# EAGLE design Servo-potenciom (EAGLE 7.2.0)
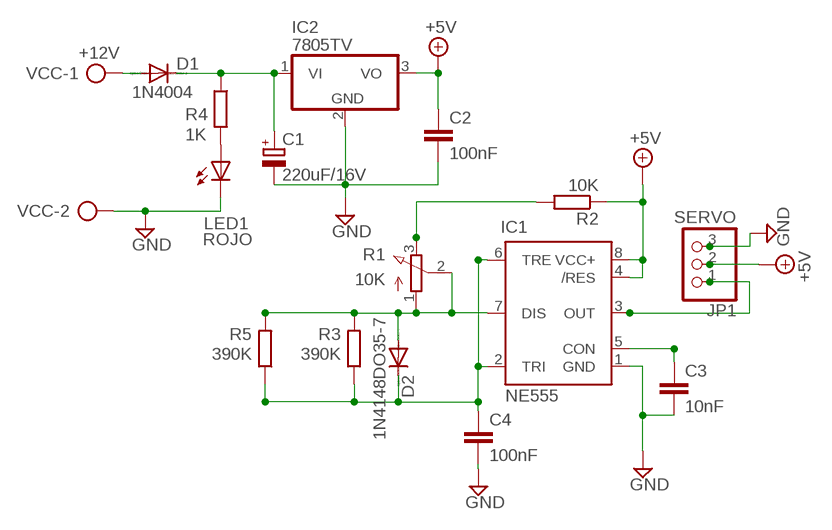
[diagram p0: schematic, sheet 1]

## Parts
C1  220uF/16V  CPOL-EUE2.5-7  [E2,5-7]
C2  100nF  C-EU050-025X075  [C050-025X075]
C3  10nF  C-EU050-025X075  [C050-025X075]
C4  100nF  C-EU050-025X075  [C050-025X075]
D1  1N4004  [DO41-10]
D2  1N4148DO35-7  [DO35-7]
IC1  NE555  [DIL-08]
IC2  7805TV  [TO220V]
JP1  SERVO  PINHD-1X3  [1X03]
LED1  ROJO  LED3MM  [LED3MM]
R1  10K  3RP/1610N  [3RP/1610N]
R2  10K  R-EU_0207/7  [0207/7]
R3  390K  R-EU_0207/7  [0207/7]
R4  1K  R-EU_0207/7  [0207/7]
R5  390K  R-EU_0207/7  [0207/7]
VCC  +12V  AK500/2-H  [AK500/2-H]

## Nets
+5V: C2.1 IC1.4(/RES) IC1.8(VCC+) IC2.3(VO) JP1.2 R2.1
GND: C1.- C2.2 C3.2 C4.2 IC1.1(GND) IC2.2(GND) JP1.3 LED1.K(C) VCC.2
N$1: D1.A VCC.1
N$2: C1.+ D1.C IC2.1(VI) R4.1
N$3: IC1.3(OUT) JP1.1
N$4: C3.1 IC1.5(CON)
N$5: R1.3(E) R2.2
N$6: D2.A IC1.7(DIS) R1.1(A) R1.2(S) R3.2 R5.2
N$7: C4.1 D2.C IC1.2(TRI) IC1.6(TRE) R3.1 R5.1
N$8: LED1.A R4.2

## Library data of the parts
C1 = rcl:CPOL-EU: POLARIZED CAPACITOR, European symbol
C2-C4 = rcl:C-EU: CAPACITOR, European symbol
D1 = diode:1N4004: DIODE general purpose rectifier, 1 A
D2 = diode:1N4148: DIODE high speed (Philips)
IC1 = st-microelectronics:NE555: General purpose bipolar Timer; MF: Arrow Electronics; MPN: NE555N; OC_FARNELL: 1467742; OC_NEWARK: 89K1486
IC2 = linear:78*: Positive VOLTAGE REGULATOR Source: http://cache.national.com/ds/LM/LM78L05.pdf http://www.fairchildsemi.com/ds/LM/LM7805.pdf
JP1 = pinhead:PINHD-1X3: PIN HEADER
LED1 = led:LED: LED OSRAM: - CHIPLED LG R971, LG N971, LY N971, LG Q971, LY Q971, LO R971, LY R971 LH N974, LH R974 LS Q976, LO Q976, LY Q976 LO Q996 - Hyper CHIPLED LW Q18S LB Q993, LB Q99A, LB R99A - SideLED LS A670, LO A670, LY A670, LG A670, LP A670 LB A673, LV A673, LT A673, LW A673 LH A674 LY A675 LS A676, LA A676, LO A676, LY A676, LW A676 LS A679, LY A679, LG A679 - Hyper Micro SIDELED® LS Y876, LA Y876, LO Y876, LY Y876 LT Y87S - SmartLED LW L88C, LW L88S LB L89C, LB L89S, LG L890 LS L89K, LO L89K, LY L89K LS L896, LA L896, LO L896, LY L896 - TOPLED LS T670, LO T670, LY T670, LG T670, LP T670 LSG T670, LSP T670, LSY T670, LOP T670, LYG T670 LG T671, LOG T671, LSG T671 LB T673, LV T673, LT T673, LW T673 LH T674 LS T676, LA T676, LO T676, LY T676, LB T676, LH T676, LSB T676, LW T676 LB T67C, LV T67C, LT T67C, LS T67K, LO T67K, LY T67K, LW E67C LS E67B, LA E67B, LO E67B, LY E67B, LB E67C, LV E67C, LT E67C LW T67C LS T679, LY T679, LG T679 LS T770, LO T770, LY T770, LG T770, LP T770 LB T773, LV T773, LT T773, LW T773 LH T774 LS E675, LA E675, LY E675, LS T675 LS T776, LA T776, LO T776, LY T776, LB T776 LHGB T686 LT T68C, LB T68C - Hyper Mini TOPLED® LB M676 - Mini TOPLED Santana® LG M470 LS M47K, LO M47K, LY M47K Source: http://www.osram.convergy.de LUXEON: - LUMILED® LXK2-PW12-R00, LXK2-PW12-S00, LXK2-PW14-U00, LXK2-PW14-V00 LXK2-PM12-R00, LXK2-PM12-S00, LXK2-PM14-U00 LXK2-PE12-Q00, LXK2-PE12-R00, LXK2-PE12-S00, LXK2-PE14-T00, LXK2-PE14-U00 LXK2-PB12-K00, LXK2-PB12-L00, LXK2-PB12-M00, LXK2-PB14-N00, LXK2-PB14-P00, LXK2-PB14-Q00 LXK2-PR12-L00, LXK2-PR12-M00, LXK2-PR14-Q00, LXK2-PR14-R00 LXK2-PD12-Q00, LXK2-PD12-R00, LXK2-PD12-S00 LXK2-PH12-R00, LXK2-PH12-S00 LXK2-PL12-P00, LXK2-PL12-Q00, LXK2-PL12-R00 Source: www.luxeon.com KINGBRIGHT: KA-3528ASYC Source: www.kingbright.com
R1 = pot:3RP/1610N: 16mm Potentiometer one level Source: http://www.alphapotentiometers.net/html/16mm_pot_2.html
R2-R5 = resistor:R-EU_: RESISTOR, European symbol
VCC = con-ptr500:AK500/2-H: CONNECTOR Aug. 2004 / PTR Meßtechnik: Die Bezeichnung der Serie AK505 wurde geändert. Es handelt sich hierbei um AK500 in horizontaler Ausführung.; OC_FARNELL: unknown; OC_NEWARK: unknown

## Board
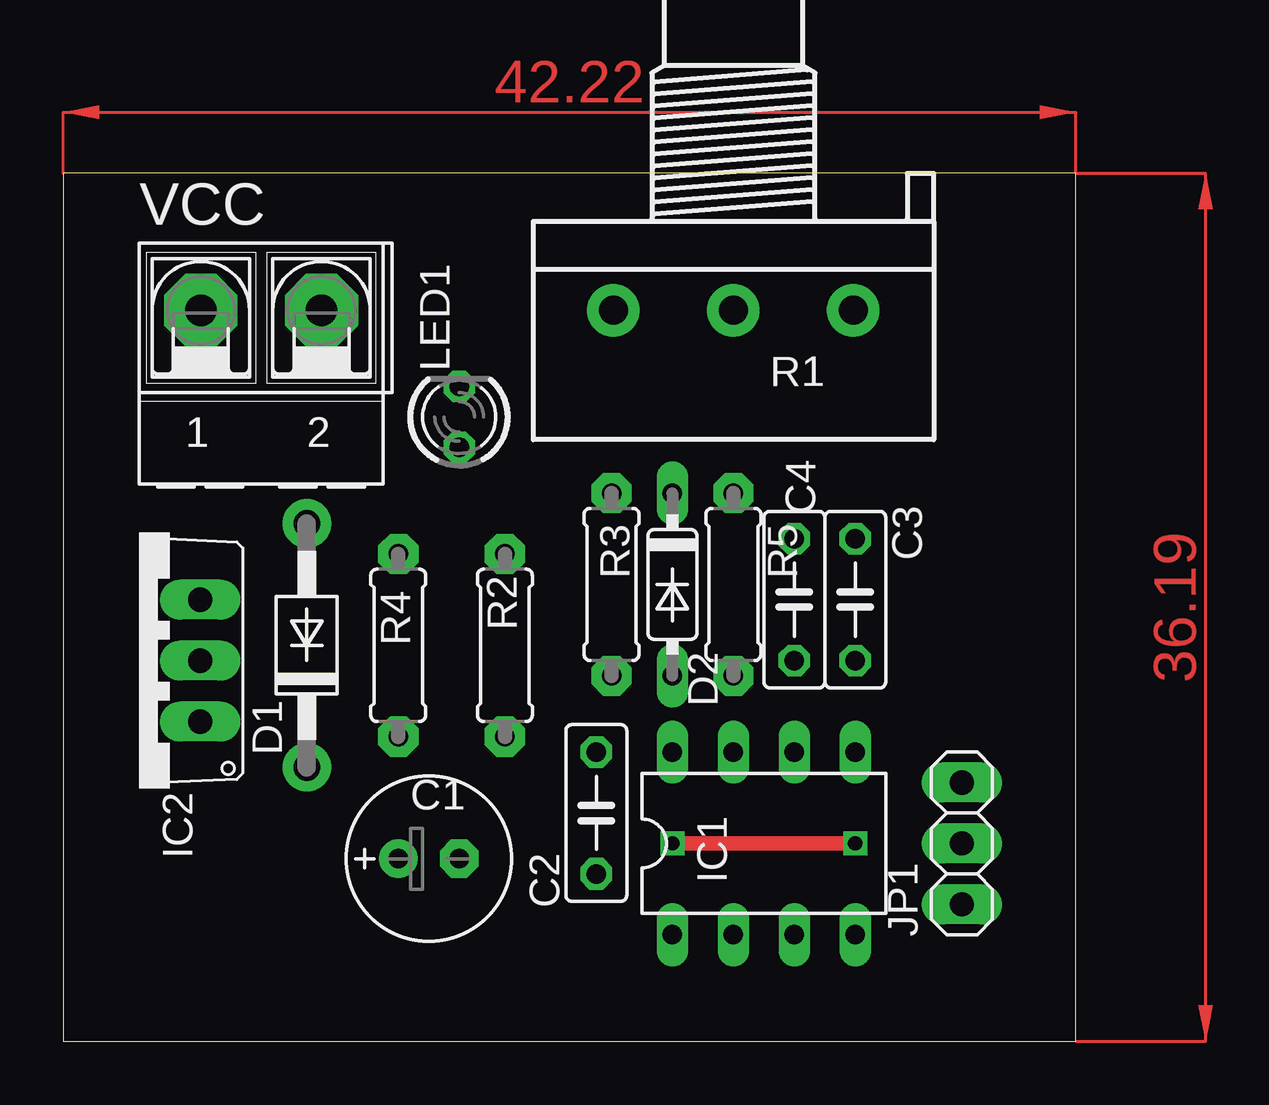
[diagram p1: board, top side]
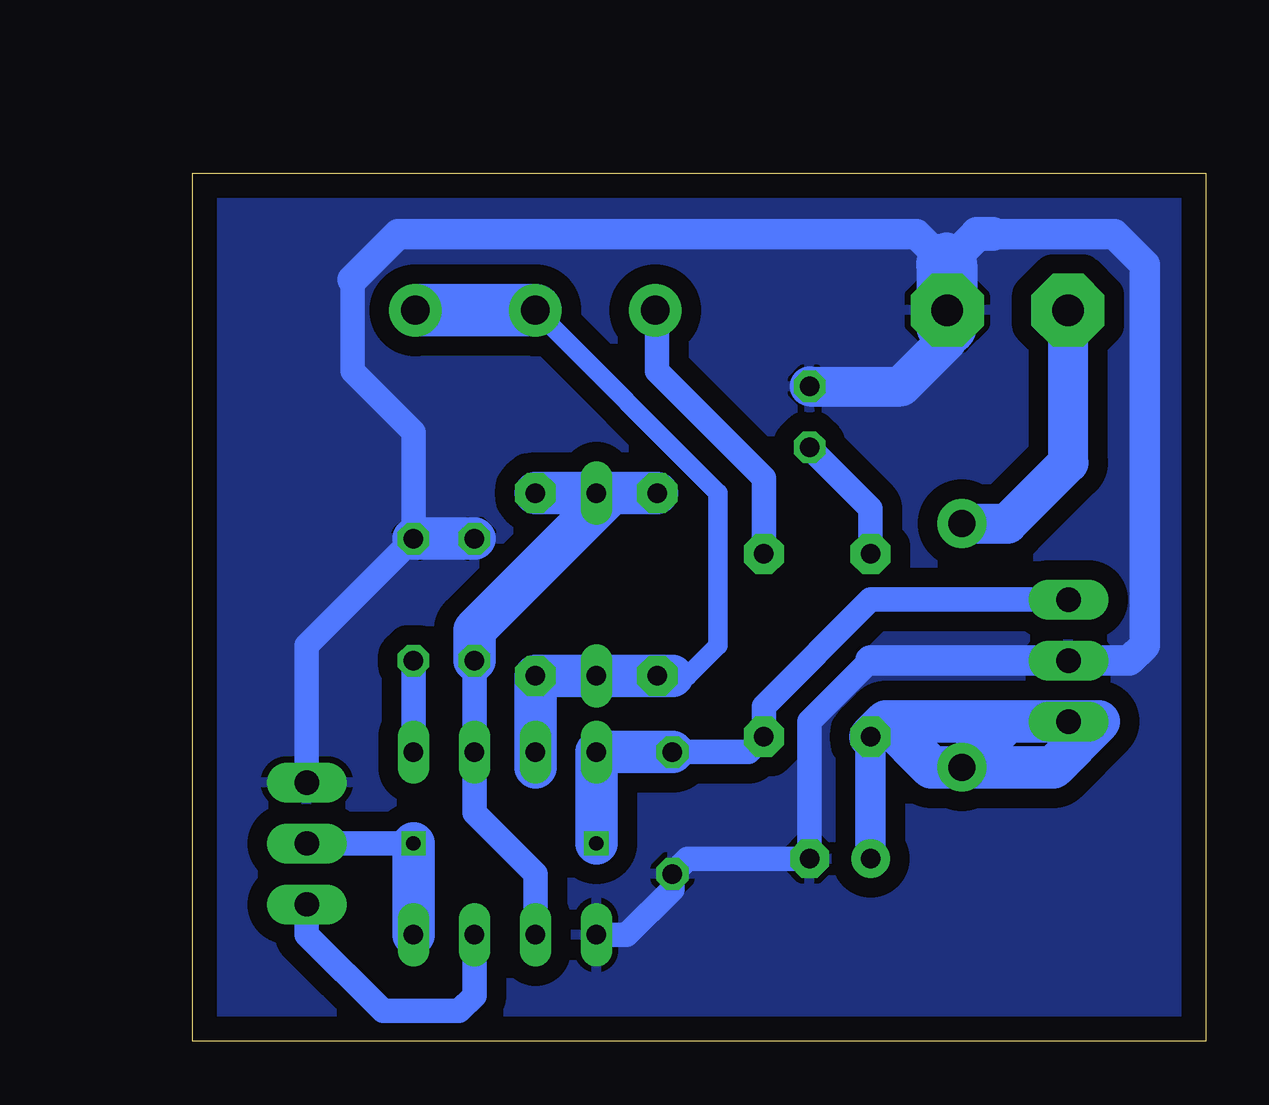
[diagram p2: board, bottom side, seen from below]

Size 42.22 x 36.19 mm. Coordinates in mm from the lower left corner, seen from the top.
Outline: 0,0 42.22,0 42.22,36.19 0,36.19 0,0
Copper layers (1*16): Top 0.035mm / dielectric 1.5mm / Bottom 0.035mm
Design rules "default": minimum track width 10mil, minimum drill 24mil, track to track 8mil, track to pad 8mil, pad to pad 8mil, via to via 8mil, smd to smd 8mil, copper to edge 40mil, drill to drill 8mil, minimum pad ring 10mil, minimum via ring 8mil, stop-mask expansion 4mil, vias tented up to drill 0mil, thermal gap 10mil

### Footprints (pad centres in the part's own frame; a part is rotated, then mirrored left to right if it is on the bottom)
E2,5-7 = drill 0.813 pad 1.6: + -1.27,0 | drill 0.813 pad 1.6 octagon: - 1.27,0
C050-025X075 = drill 0.813 octagon: 1 -2.54,0; 2 2.54,0
DO41-10 = drill 1.118 pad 2.032: A 5.08,0; C -5.08,0
DO35-7 = drill 0.813 long: A 3.81,0; C -3.81,0
DIL-08 = drill 0.813 long: 1 -3.81,-3.81; 2 -1.27,-3.81; 3 1.27,-3.81; 4 3.81,-3.81; 5 3.81,3.81; 6 1.27,3.81; 7 -1.27,3.81; 8 -3.81,3.81
TO220V = drill 1.016 pad 1.676 long: 1 -2.54,-2.54; 2 0,-2.54; 3 2.54,-2.54
1X03 = drill 1.016 pad 1.676 long: 1 -2.54,0; 2 0,0; 3 2.54,0
LED3MM = drill 0.813 octagon: A -1.27,0; K 1.27,0
3RP/1610N = drill 1.2 pad 2.184: 1 -5,0; 2 0,0; 3 5,0
0207/7 = drill 0.813 pad 1.676 octagon: 1 -3.81,0; 2 3.81,0
AK500/2-H = drill 1.321 pad 3.048 octagon: 1 -2.515,0; 2 2.515,0

### Placement (x,y rotation side)
C1  15.24,7.62 0 top
C2  22.23,9.53 270 top
C3  33.02,18.42 90 top
C4  30.48,18.42 90 top
D1  10.16,16.51 90 top
D2  25.4,19.05 270 top
IC1  29.21,8.25 0 top
IC2  3.18,15.88 90 top
JP1  37.46,8.25 90 top
LED1  16.51,26.04 90 top
R1  27.94,30.48 180 top
R2  18.41,16.51 90 top
R3  22.86,19.05 270 top
R4  13.97,16.51 90 top
R5  27.94,19.05 270 top
VCC  8.26,30.48 0 top

### Tracks (layer width: path | path; a pad name or v marks a point on that pad's centre or on a via)
+5V  (via drill 0.6)
  Top 0.61: v25.4,8.25 v33.02,8.25
  Bottom 1.016: IC2.3 13.97,18.42 18.41,13.97 R2.1 19.05,12.07 C2.1 | JP1.2 v33.02,8.25
  Bottom 1.778: C2.1 IC1.8 v25.4,8.25 | v33.02,8.25 IC1.4
GND
  Bottom 1.016: 34.29,33.02 35.56,31.75 35.56,27.94 33.02,25.4 C3.2 37.46,16.51 JP1.3 | IC2.2 13.97,15.88 16.51,13.34 C1.- 21.59,7.62 C2.2 22.23,6.35 24.13,4.45 IC1.1
  Bottom 1.27: 13.97,15.88 3.18,15.88 2.54,16.51 2.54,32.39 3.81,33.66 8.89,33.66 | 10.8,33.02 11.43,33.02 12.06,33.66 33.66,33.66 35.56,31.75
  Bottom 1.422: 8.89,33.66 9.52,33.66 10.48,32.7 | 10.48,32.7 10.8,32.39 | 10.8,33.02 10.48,32.7
  Bottom 1.676: LED1.K 12.7,27.31 10.8,29.21 10.8,29.85 10.8,30.46 VCC.2
  Bottom 1.778: C4.2 C3.2
  Bottom 2.54: 10.8,32.39 10.8,29.85
  pour Bottom (isolate 0.813): 0,36.2 41.91,36.2 42.55,36.2 42.55,0 0,0 0,0.64
N$1
  Bottom 1.016: VCC.1 5.71,30.48
  Bottom 1.676: D1.A 8.26,21.59 5.71,24.13 5.71,30.46 VCC.1
N$2
  Bottom 1.27: C1.+ R4.1
  Bottom 1.778: IC2.1 4.45,13.34 6.35,11.43 D1.C | IC2.1 13.34,13.34 | 13.34,13.34 R4.1 | 13.34,13.34 11.43,11.43 D1.C | IC2.1 8.26,13.34 D1.C
N$3
  Bottom 1.016: IC1.3 30.48,1.91 31.12,1.27 34.29,1.27 37.46,4.45 JP1.1
N$4
  Bottom 1.016: IC1.5 C3.1
N$5
  Bottom 1.016: R2.2 18.41,23.5 22.86,27.94 22.86,30.4 R1.3
N$6
  Bottom 0.813: 22.23,15.24 21.59,15.24 20.32,16.51 20.32,22.86 R1.2
  Bottom 1.016: 26.03,15.24 D2.A R3.2 22.23,15.24
  Bottom 1.778: 27.94,13.34 IC1.7 | 27.94,11.43 IC1.7 | IC1.7 R5.2 22.23,15.24
  Bottom 2.184: R1.1 R1.2
N$7
  Bottom 1.016: C4.1 IC1.6 30.48,9.53 27.94,6.98 IC1.2 | R3.1 24.77,22.86 D2.C
  Bottom 1.778: C4.1 30.48,17.14 24.77,22.86 | R5.1 R3.1
N$8
  Bottom 1.016: R4.2 13.97,22.22 LED1.A
(copper drawn outside any net)
  shapes: Top area x2